# EAGLE design CircuitBoard (EAGLE 7.7.0)
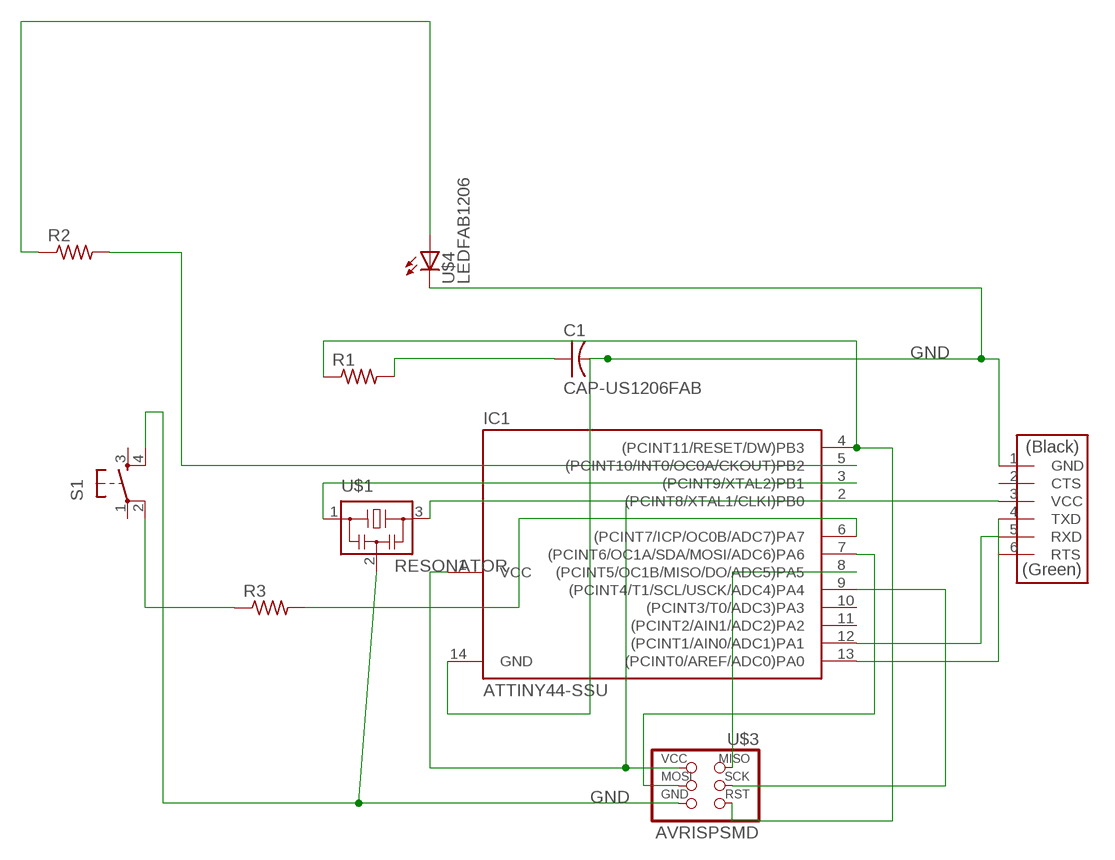
[diagram p0: schematic, sheet 1]

## Parts
C1  CAP-US1206FAB  [C1206FAB]
IC1  ATTINY44-SSU  [SOIC14]
R1  RES-US1206FAB  [R1206FAB]
R2  RES-US1206FAB  [R1206FAB]
R3  RES-US1206FAB  [R1206FAB]
S1  6MM_SWITCH6MM_SWITCH  [6MM_SWITCH]
U$1  RESONATOR  [EFOBM]
U$2  FTDI-SMD-HEADER  [1X06SMD]
U$3  AVRISPSMD  [2X03SMD]
U$4  LEDFAB1206  [LED1206FAB]

## Nets
GND: C1.2 IC1.14(GND) S1.4(S1) U$1.2 U$2.1(GND) U$3.6(GND) U$4.2(C)
N$2: IC1.7((PCINT6/OC1A/SDA/MOSI/ADC6)PA6) U$3.4(MOSI)
N$4: IC1.8((PCINT5/OC1B/MISO/DO/ADC5)PA5) U$3.1(MISO)
N$5: IC1.9((PCINT4/T1/SCL/USCK/ADC4)PA4) U$3.3(SCK)
N$6: IC1.4((PCINT11/RESET/DW)PB3) R1.1 U$3.5(RST)
N$7: IC1.3((PCINT9/XTAL2)PB1) U$1.1
N$8: IC1.2((PCINT8/XTAL1/CLKI)PB0) U$1.3
N$9: C1.1 R1.2
N$11: IC1.12((PCINT1/AIN0/ADC1)PA1) U$2.5(RXD)
N$12: IC1.13((PCINT0/AREF/ADC0)PA0) U$2.4(TXD)
N$13: IC1.5((PCINT10/INT0/OC0A/CKOUT)PB2) R2.2
N$14: R2.1 U$4.1(A)
N$15: IC1.6((PCINT7/ICP/OC0B/ADC7)PA7) R3.2
N$16: R3.1 S1.2(P1)
VCC: IC1.1(VCC) U$2.3(VCC) U$3.2(VCC)
Unconnected: IC1.10((PCINT3/T0/ADC3)PA3) IC1.11((PCINT2/AIN1/ADC2)PA2) S1.1(P) S1.3(S) U$2.2(CTS) U$2.6(RTS)

## Library data of the parts
C1 = fab:CAP-US
IC1 = fab:ATTINY44
R1-R3 = fab:RES-US: Resistor (US Symbol) Variants with postfix FAB are widened to allow the routing of internal traces
S1 = fab:6MM_SWITCH: OMRON SWITCH
U$1 = fab:RESONATOR
U$2 = fab:FTDI-SMD-HEADER
U$3 = fab:AVRISP
U$4 = fab:LED: LED

## Board
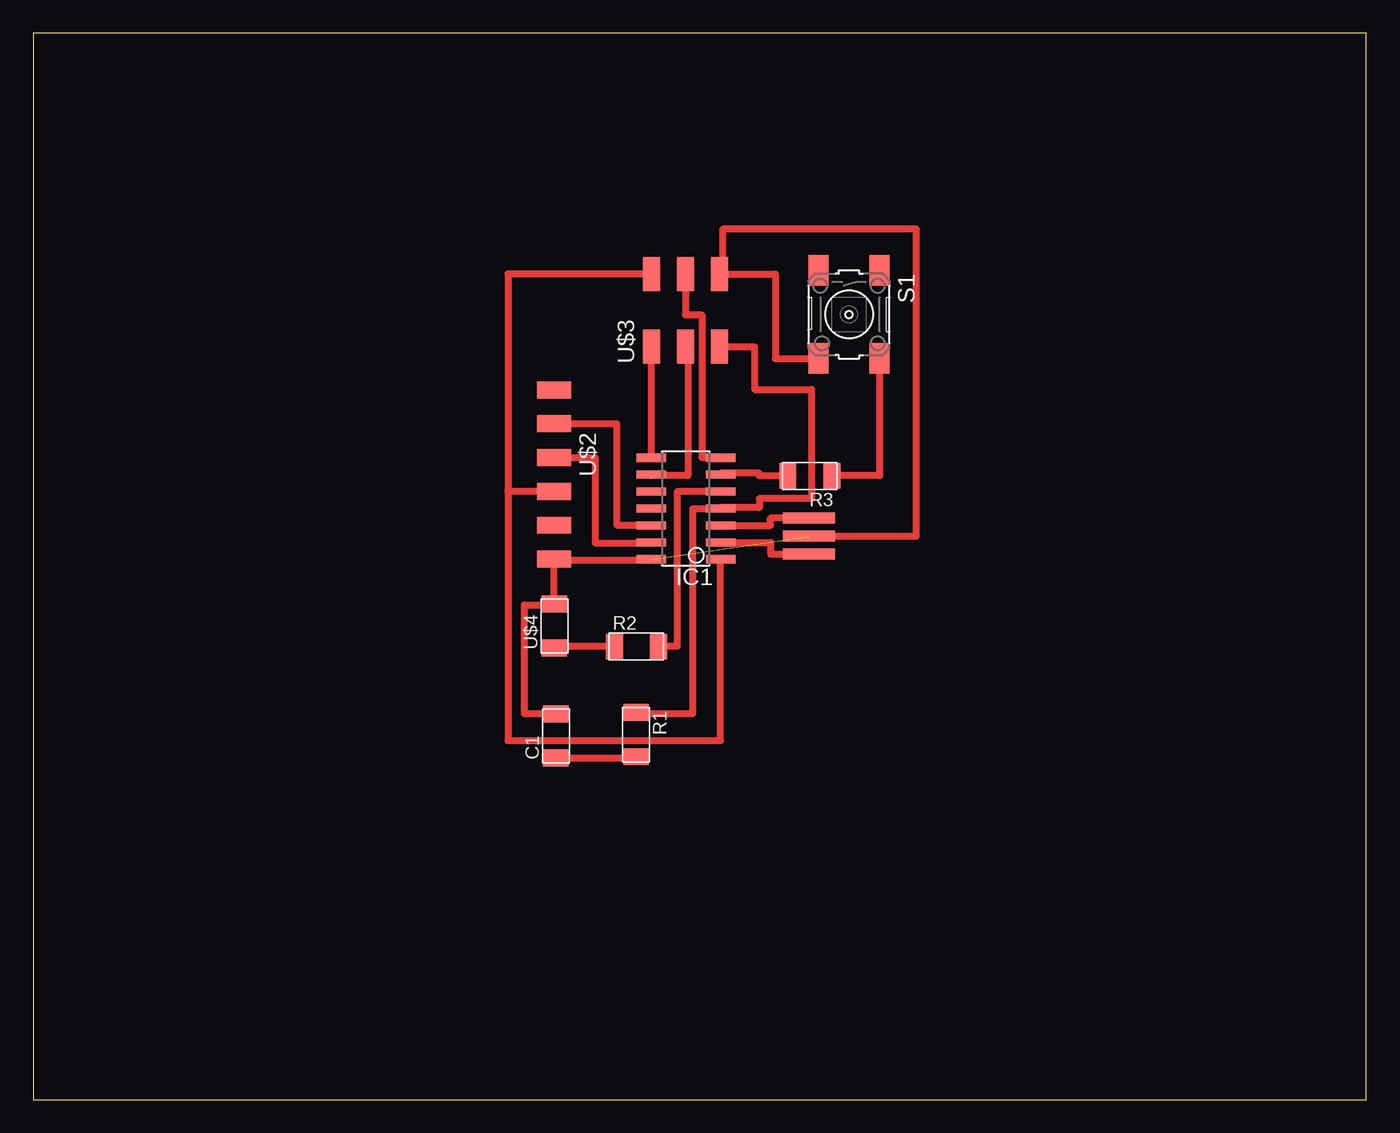
[diagram p1: board, top side]

Size 100 x 80 mm. Coordinates in mm from the lower left corner, seen from the top.
Outline: 0,0 100,0 100,80 0,80 0,0
Copper layers (1*16): Top 0.035mm / dielectric 1.5mm / Bottom 0.035mm
Design rules "default *": minimum track width 10mil, minimum drill 24mil, track to track 15mil, track to pad 15mil, pad to pad 15mil, via to via 15mil, smd to smd 8mil, copper to edge 40mil, drill to drill 8mil, minimum pad ring 10mil, minimum via ring 8mil, stop-mask expansion 4mil, vias tented up to drill 0mil, thermal gap 10mil

### Footprints (pad centres in the part's own frame; a part is rotated, then mirrored left to right if it is on the bottom)
C1206FAB = smd 1.27 x 1.905: 1 -1.651,0; 2 1.651,0
SOIC14 = smd 0.61 x 2.21: 1 -3.81,-2.603; 2 -2.54,-2.603; 3 -1.27,-2.603; 4 0,-2.603; 5 1.27,-2.603; 6 2.54,-2.603; 7 3.81,-2.603; 8 3.81,2.603; 9 2.54,2.603; 10 1.27,2.603; 11 0,2.603; 12 -1.27,2.603; 13 -2.54,2.603; 14 -3.81,2.603
R1206FAB = smd 1.27 x 1.905: 1 -1.651,0; 2 1.651,0
6MM_SWITCH = smd 2.286 x 1.524: 1 -3.302,2.286; 2 3.302,2.286; 3 -3.302,-2.286; 4 3.302,-2.286
EFOBM = smd 0.8 x 3.9: 1 -1.35,0; 2 0,0; 3 1.35,0
1X06SMD = smd 2.54 x 1.27: 1 0,6.35; 2 0,3.81; 3 0,1.27; 4 0,-1.27; 5 0,-3.81; 6 0,-6.35
2X03SMD = smd 2.54 x 1.27: 1 -2.54,2.54; 2 2.92,2.54; 3 -2.54,0; 4 2.92,0; 5 -2.54,-2.54; 6 2.92,-2.54
LED1206FAB = smd 1.27 x 1.905: 1 -1.651,0; 2 1.651,0

### Placement (x,y rotation side)
C1  39.2,27.29 90 top
IC1  48.96,44.34 90 top
R1  45.22,27.38 270 top
R2  45.24,33.98 0 top
R3  58.25,46.79 180 top
S1  61.2,58.9 270 top
U$1  58.21,42.28 270 top
U$2  39.07,46.9 180 top
U$3  48.93,59.02 90 top
U$4  39.09,35.54 90 top

### Tracks (layer width: path | path; a pad name or v marks a point on that pad's centre or on a via)
GND  (1 unrouted)
  Top 0.254: 58.2,42.27 U$1.2 | 39.09,37.26 U$4.2 | 46.18,40.46 IC1.14 | 39.09,40.46 U$2.1
  Top 0.508: U$3.6 51.75,61.94 | 51.75,61.94 51.75,65.34 66.22,65.34 66.22,42.26 58.2,42.26 U$1.2 | 51.75,61.94 55.67,61.94 55.67,55.58 58.91,55.58 S1.4 | 46.18,40.46 39.06,40.46 U$2.1 39.06,37.26 39.09,37.26 | C1.2 36.85,28.94 36.85,37.11 39.09,37.11 U$4.2
N$2
  Top 0.508: U$3.4 48.92,58.89 50.17,58.89 50.17,48.17 51.56,48.17 IC1.7
N$4
  Top 0.508: U$3.1 46.35,56.48 IC1.8
N$5
  Top 0.254: 47.32,47.09 46.41,47.09 IC1.9 | 48.92,56.46 U$3.3
  Top 0.508: 48.92,56.46 49.11,56.46 49.11,46.81 46.35,46.81 IC1.9
N$6
  Top 0.254: U$3.5 51.54,56.48 | 51.56,44.32 IC1.4 | R1.1
  Top 0.508: 51.54,56.48 54.11,56.48 54.11,53.28 58.39,53.28 58.39,45.09 54.47,45.09 54.47,44.41 51.56,44.41 IC1.4 | 51.56,44.32 49.47,44.32 49.47,28.95 45.22,28.95 R1.1
N$7
  Top 0.508: IC1.3 55.31,43.07 55.31,43.63 U$1.1
N$8
  Top 0.508: IC1.2 55.31,41.8 55.31,40.92 58.2,40.92 U$1.3
N$9
  Top 0.508: C1.1 45.22,25.63 R1.2
N$11
  Top 0.508: U$2.5 43.77,50.7 43.77,43.12 46.35,43.12 IC1.12
N$12
  Top 0.508: U$2.4 42.15,48.16 42.15,41.77 46.35,41.77 IC1.13
N$13
  Top 0.508: IC1.5 48.3,45.61 48.3,34.01 46.9,34.01 R2.2
N$14
  Top 0.508: R2.1 39.09,33.98 U$4.1
N$15
  Top 0.508: R3.2 54.45,46.79 54.45,46.99 51.56,46.99 IC1.6
N$16
  Top 0.254: R3.1 59.9,46.66 | S1.2 63.6,55.6
  Top 0.508: 63.6,55.6 S1.2 63.49,46.81 59.9,46.81 R3.1
VCC
  Top 0.508: U$3.2 35.62,61.94 35.62,45.72 35.62,45.62 | 35.62,45.62 35.62,26.94 51.56,26.94 IC1.1 | U$2.3 35.62,45.62